# EasyEDA Pro project RP-LoRA_Mini_v2-1.eprj

# Schematic Schematic
Board Name: Board1; Create Date: 2025-02-13; Page Name: P1; Project Name: RP-LoRA_Mini_v2; Schematic Name: LoRa_Mini_v2.1; Update Date: 2025-08-31; Company: Wizado F4ISE; Drawn: F4ISE; Page Size: A4; Reviewed: F4HVV; Version: V2.1
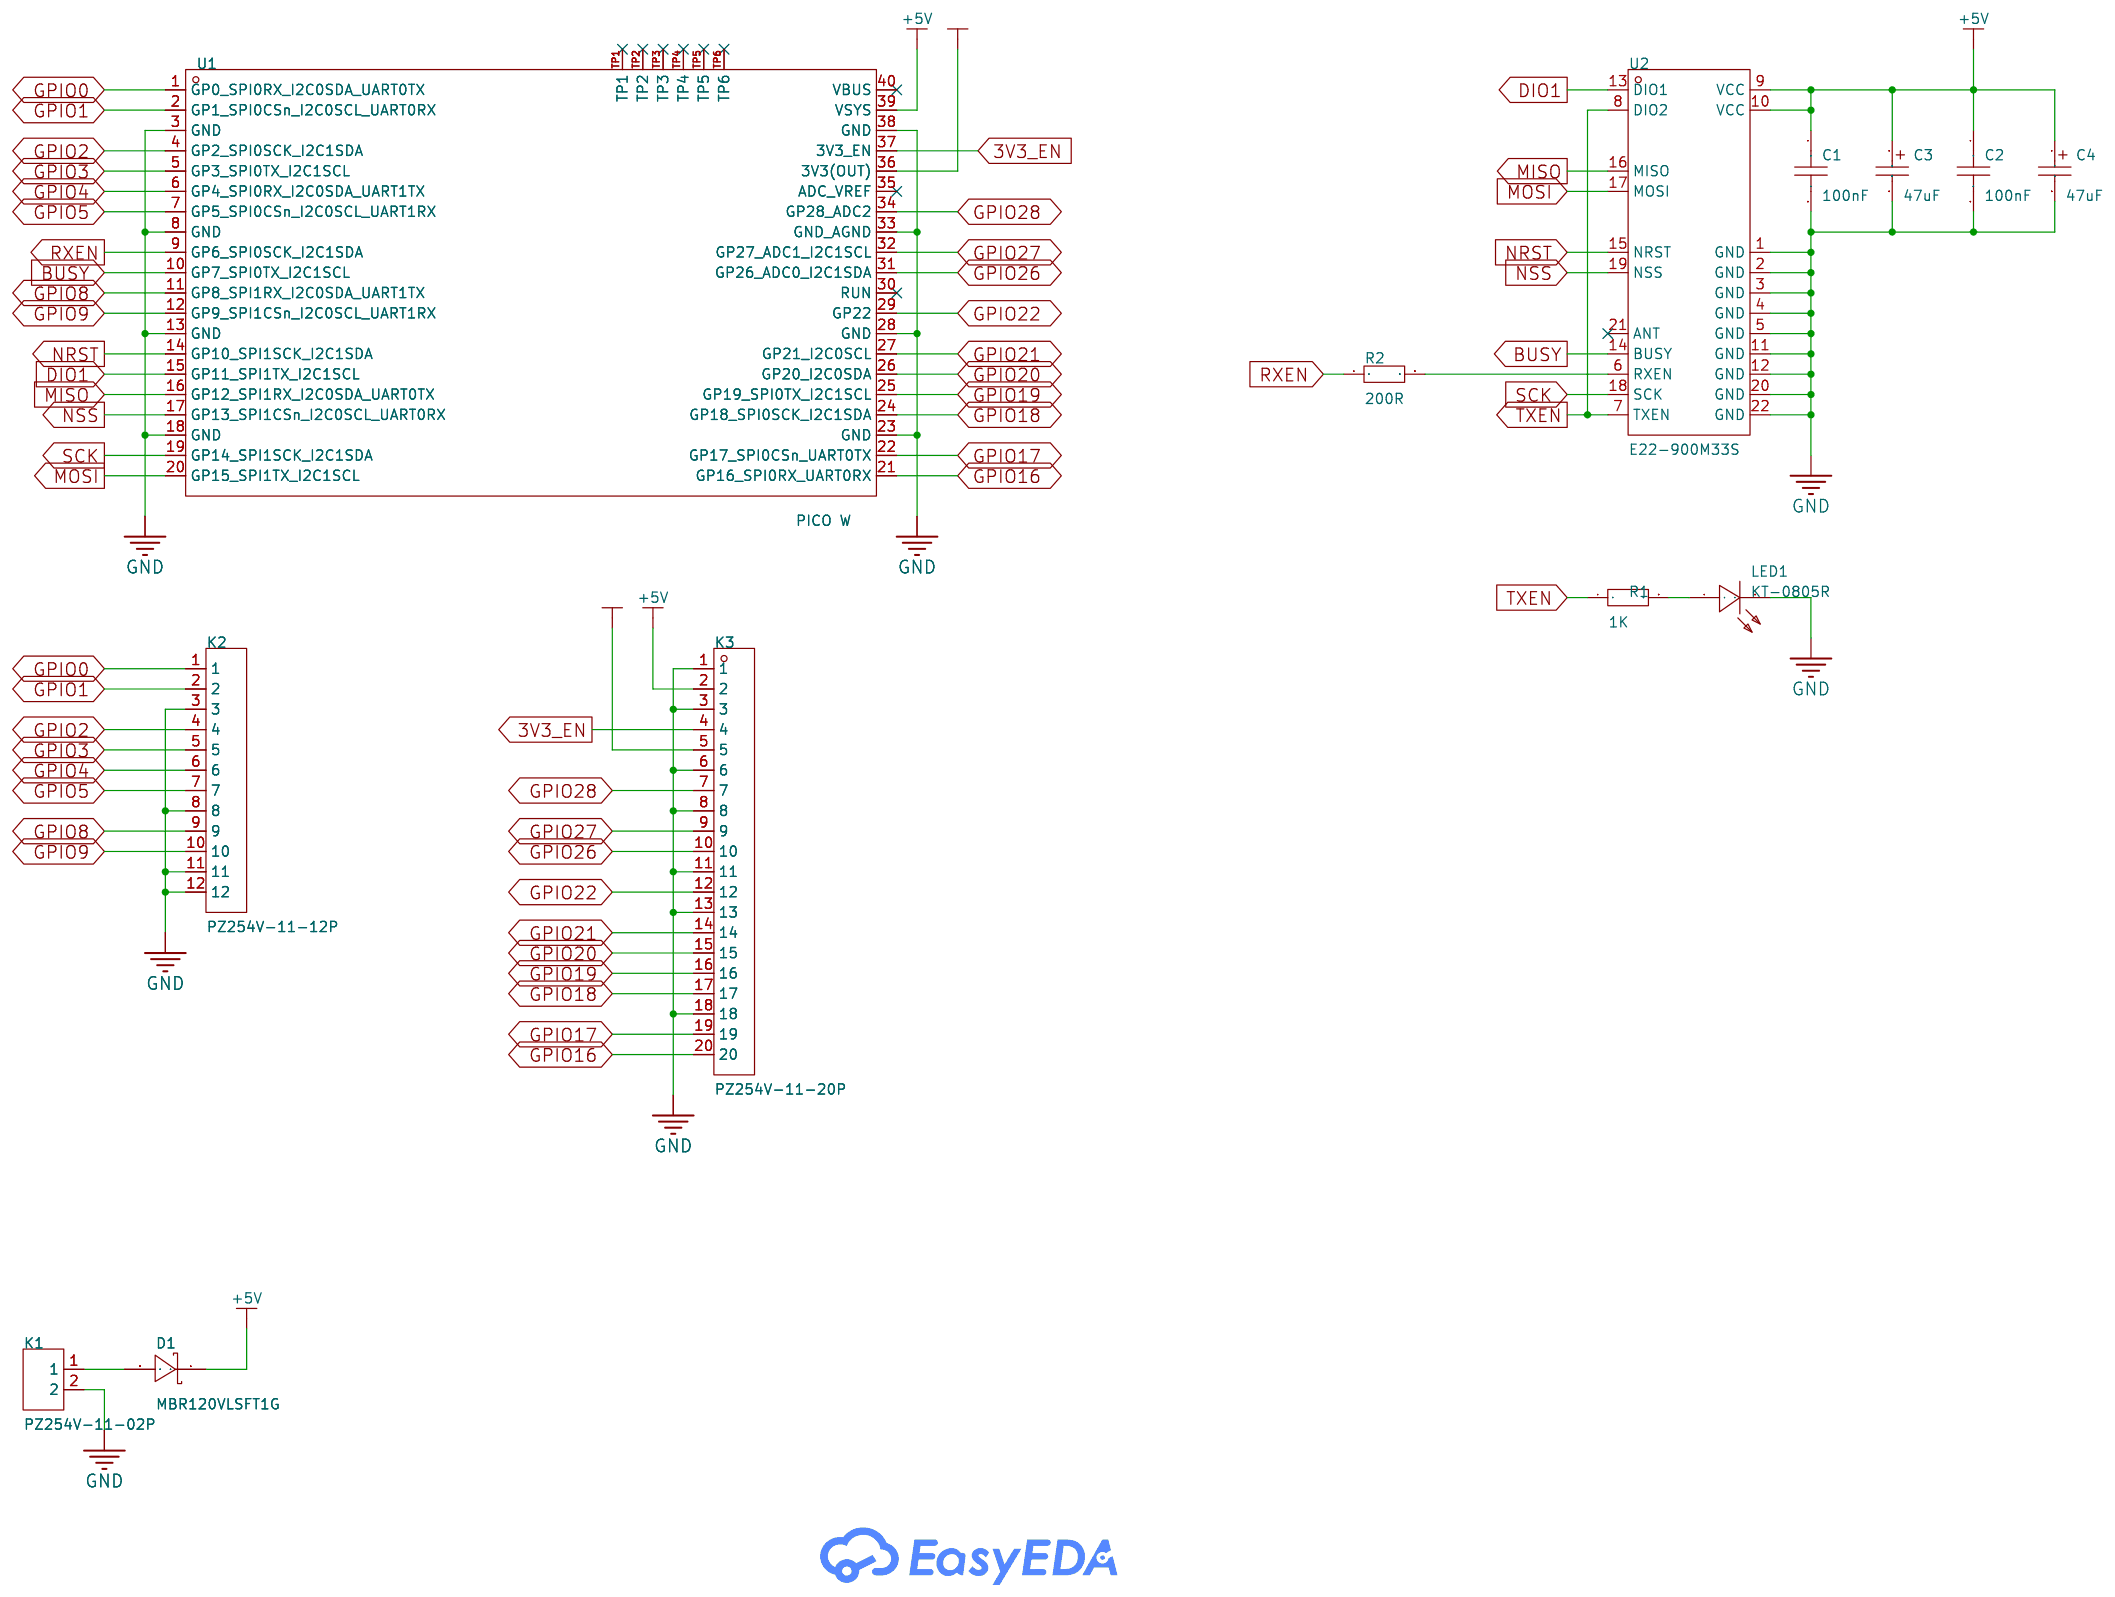
[diagram p0: schematic sheet]

## Parts
C1  100nF  [C0603]
C2  100nF  [C0603]
C3  47uF  [CASE-B_3528]
C4  47uF  [CASE-B_3528]
D1  MBR120VLSFT1G  [SOD-123F_L2.8-W1.8-LS3.7-RD]
K1  PZ254V-11-02P  [HDR-TH_2P-P2.54-V-M]
K2  PZ254V-11-12P  [HDR-TH_12P-P2.54-V-M]
K3  PZ254V-11-20P  [HDR-TH_20P-P2.54-V-M-4]
LED1  KT-0805R  [LED0805-R-RD]
R1  1K  [R0603]
R2  200R  [R0603]
U1  PICO W  [COMM-SMD_L51.0-W21.0-P2.54_PICOW]
U2  E22-900M33S  [COMM-SMD_22P-P2.54-L38.5-W24.0_E22-400M33S]

## Library data of the parts
C1 C2 = CAP_0603: Supplier Footprint: 0603
C3 C4 = CA45-B-10V-47uF-K: LCSC Part Name: 47uF ±10% 10V; Supplier Part: C136658; Manufacturer: CEC(振华新云); Supplier Footprint: CASE-B-3528-19(mm); JLCPCB Part Class: Extended Part; Datasheet: https://item.szlcsc.com/datasheet/CA45-B-10V-47uF-K/147974.html; Supplier: LCSC; Tolerance: ±10%; Voltage Rating: 10V; Equivalent Series Resistance(ESR): 2.4Ω@100kHz; Operating Temperature: -55℃~+125℃
D1 = MBR120VLSFT1G: LCSC Part Name: 电压:20V 电流:1A; Supplier Part: C223608; Manufacturer: onsemi(安森美); Supplier Footprint: SOD-123FL; JLCPCB Part Class: Extended Part; Datasheet: https://atta.szlcsc.com/upload/public/pdf/source/20221020/29D26ECD33A75D76A8E47ED9553F3BCF.pdf; Supplier: LCSC; Forward Voltage (Vf@If): 300mV@1A; Reverse Voltage (Vr): 20V; Average Rectified Current (Io): 1A; Reverse Leakage Current (Ir): 600uA@20V
K1 = PZ254V-11-02P: LCSC Part Name: 1x2P 间距:2.54mm 方针 直插; Supplier Part: C492401; Manufacturer: XFCN(兴飞); Supplier Footprint: 插件,P=2.54mm; JLCPCB Part Class: Extended Part; Datasheet: https://atta.szlcsc.com/upload/public/pdf/source/20200309/C492401_A812433581A9B211A7FFA413ADDFF0E5.pdf; Supplier: LCSC; Pin Structure: 1x2P; Pitch: 2.54mm; Circluar Pins/Square Pins: Policy; Mounting Type: Straight; Number of Rows: Single Row; Number of Pins: 2P; Length of Mating Pin: 6mm; Insulation Height: 2.5mm; Length of End Connection Pin: 3mm; Contact Material: Brass; Operating Temperature: -40℃~+105℃; Color: Black
K2 = PZ254V-11-12P: LCSC Part Name: 1x12P 间距:2.54mm 方针 直插; Supplier Part: C2840012; Manufacturer: XFCN(兴飞); Supplier Footprint: 插件,P=2.54mm; JLCPCB Part Class: Extended Part; Datasheet: https://atta.szlcsc.com/upload/public/pdf/source/20200309/C492403_F9F19131791D08044AD4F84F8E751A34.pdf; Supplier: LCSC; Pin Structure: 1x12P; Pitch: 2.54mm; Circluar Pins/Square Pins: Policy; Mounting Type: Straight; Number of Rows: Single Row; Number of Pins: 12P; Current Rating: 3A; Voltage Rating (Max): 250V; Length of Mating Pin: 6mm; Insulation Height: 2.5mm; Length of End Connection Pin: 3mm; Operating Temperature: -40℃~+105℃; Color: Black
K3 = PZ254V-11-20P: LCSC Part Name: 排针2.54mm间距 单排 1x20P 直插 方针; Supplier Part: C22465880; Manufacturer: XFCN(兴飞); Supplier Footprint: 插件,P=2.54mm; JLCPCB Part Class: Extended Part; Datasheet: https://atta.szlcsc.com/upload/public/pdf/source/20240617/C325FF89D0FCE13B2A10BE2D3D7E6B84.pdf; Supplier: LCSC
LED1 = KT-0805R: LCSC Part Name: 0805 红灯 高亮; Supplier Part: C2295; Manufacturer: KENTO; Supplier Footprint: 0805; JLCPCB Part Class: Extended Part; Supplier: LCSC
R1 R2 = Res_0603: Supplier Footprint: 0603
U1 = PICO W: Supplier Part: C7203003; Manufacturer: Raspberry Pi(树莓派); JLCPCB Part Class: Extended Part; Datasheet: https://atta.szlcsc.com/upload/public/pdf/source/20230906/10B4C0665D815973E97A5F4971CA719F.pdf; Supplier: LCSC
U2 = E22-900M33S: LCSC Part Name: LoRa扩频无线模块2W大功率升级SX1268/1262芯片SPI 915M; Supplier Part: C22399506; Manufacturer: EBYTE(亿佰特); Supplier Footprint: SMD,38.5x24mm; JLCPCB Part Class: Extended Part; Datasheet: https://atta.szlcsc.com/upload/public/pdf/source/20240515/3933576661C2C75726A6AADE06C4B1B1.pdf; Supplier: LCSC; Output Power: 33.5dBm; Support Interface: SPI; Modulation System: LoRa；GFSK; Operating Voltage: 3.3V~5.5V; Antenna Type: Stamp hole antenna；IPEX Interface; Receive  Current: 15mA; Send  Current: 1200mA; Sensitivity: -136dBm; Communication Distance: 16km

## Nets
3V3_EN: K3.4 U1.37(3V3_EN)
+3V3: K3.5 U1.36(3V3(OUT))
+5V: C1.1 C2.1 C3.1 C4.1 D1.1(K) K3.2 U1.39(VSYS) U2.9(VCC) U2.10(VCC)
GND: C1.2 C2.2 C3.2 C4.2 K1.2 K2.3 K2.8 K2.11 K2.12 K3.1 K3.3 K3.6 K3.8 K3.11 K3.13 K3.18 LED1.2(K) U1.3(GND) U1.8(GND) U1.13(GND) U1.18(GND) U1.23(GND) U1.28(GND) U1.33(GND_AGND) U1.38(GND) U2.1(GND) U2.2(GND) U2.3(GND) U2.4(GND) U2.5(GND) U2.11(GND) U2.12(GND) U2.20(GND) U2.22(GND)
BUSY: U1.10(GP7_SPI0TX_I2C1SCL) U2.14(BUSY)
DIO1: U1.15(GP11_SPI1TX_I2C1SCL) U2.13(DIO1)
GPIO0: K2.1 U1.1(GP0_SPI0RX_I2C0SDA_UART0TX)
GPIO1: K2.2 U1.2(GP1_SPI0CSn_I2C0SCL_UART0RX)
GPIO2: K2.4 U1.4(GP2_SPI0SCK_I2C1SDA)
GPIO3: K2.5 U1.5(GP3_SPI0TX_I2C1SCL)
GPIO4: K2.6 U1.6(GP4_SPI0RX_I2C0SDA_UART1TX)
GPIO5: K2.7 U1.7(GP5_SPI0CSn_I2C0SCL_UART1RX)
GPIO8: K2.9 U1.11(GP8_SPI1RX_I2C0SDA_UART1TX)
GPIO9: K2.10 U1.12(GP9_SPI1CSn_I2C0SCL_UART1RX)
GPIO16: K3.20 U1.21(GP16_SPI0RX_UART0RX)
GPIO17: K3.19 U1.22(GP17_SPI0CSn_UART0TX)
GPIO18: K3.17 U1.24(GP18_SPI0SCK_I2C1SDA)
GPIO19: K3.16 U1.25(GP19_SPI0TX_I2C1SCL)
GPIO20: K3.15 U1.26(GP20_I2C0SDA)
GPIO21: K3.14 U1.27(GP21_I2C0SCL)
GPIO22: K3.12 U1.29(GP22)
GPIO26: K3.10 U1.31(GP26_ADC0_I2C1SDA)
GPIO27: K3.9 U1.32(GP27_ADC1_I2C1SCL)
GPIO28: K3.7 U1.34(GP28_ADC2)
MISO: U1.16(GP12_SPI1RX_I2C0SDA_UART0TX) U2.16(MISO)
MOSI: U1.20(GP15_SPI1TX_I2C1SCL) U2.17(MOSI)
NRST: U1.14(GP10_SPI1SCK_I2C1SDA) U2.15(NRST)
NSS: U1.17(GP13_SPI1CSn_I2C0SCL_UART0RX) U2.19(NSS)
RXEN: R2.1 U1.9(GP6_SPI0SCK_I2C1SDA)
SCK: U1.19(GP14_SPI1SCK_I2C1SDA) U2.18(SCK)
TXEN: R1.1 U2.7(TXEN) U2.8(DIO2)
$1N3995: LED1.1(A) R1.2
$1N5348: D1.2(A) K1.1
$1N14481: R2.2 U2.6(RXEN)

Not connected (* = marked no-connect by the designer): U1 30(RUN)* 35(ADC_VREF)* 40(VBUS)* TP1* TP2* TP3* TP4* TP5* TP6*; U2 21(ANT)*

# Board PCB
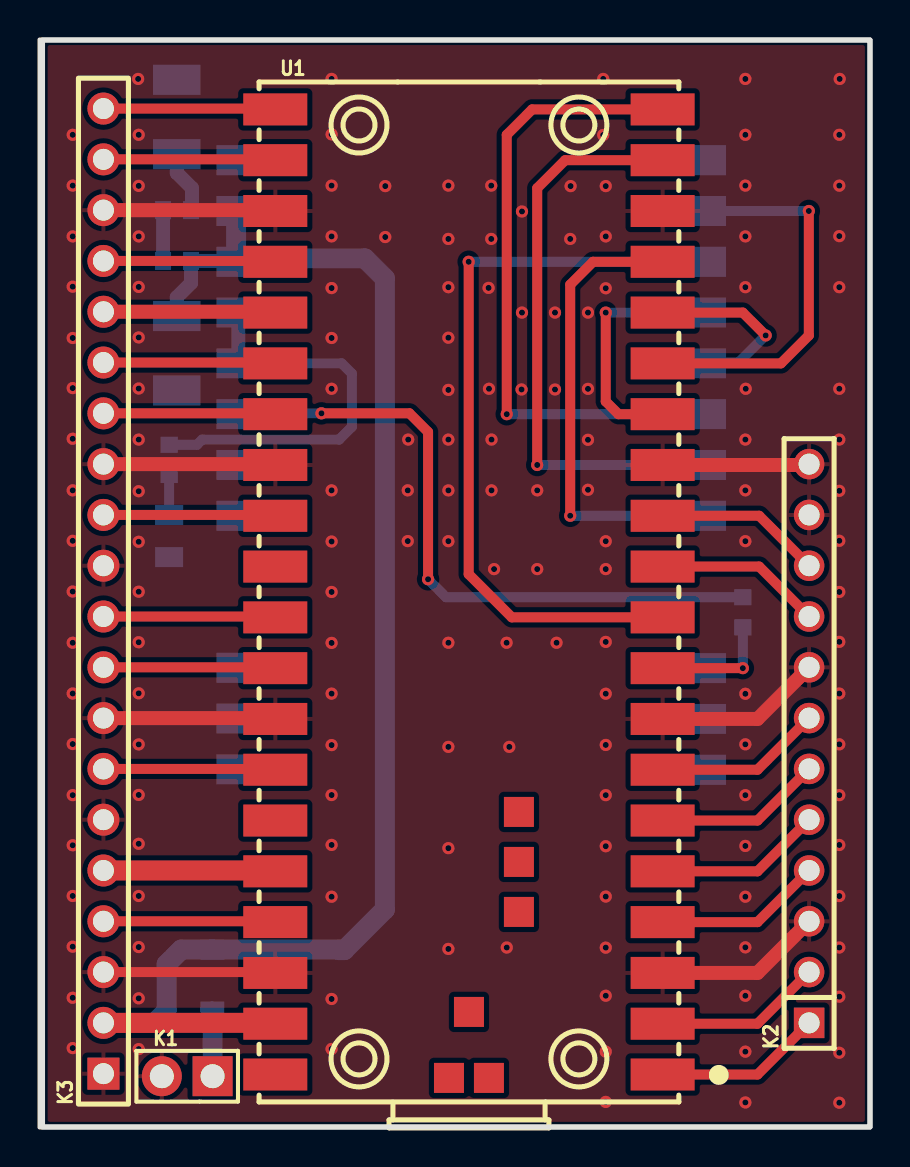
[diagram p1: board, top side]
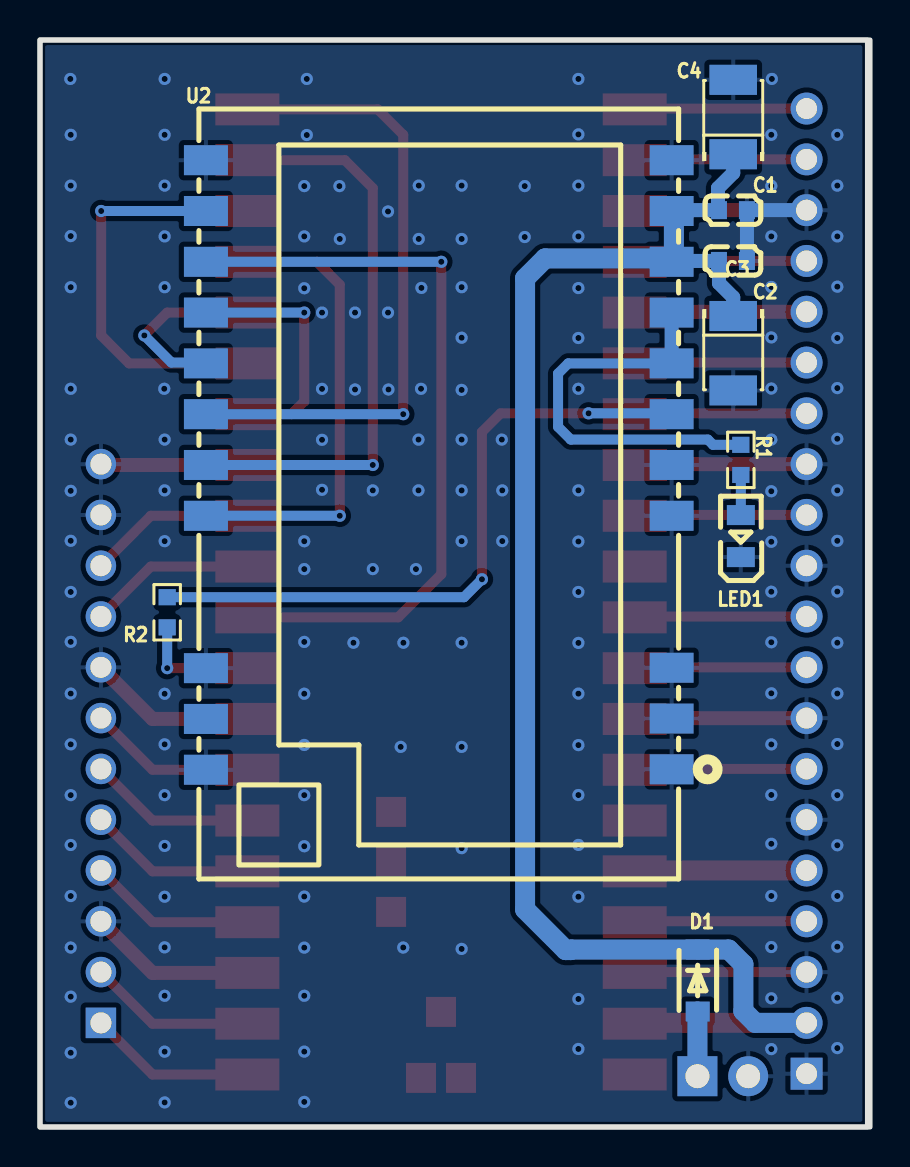
[diagram p2: board, bottom side, seen from below]

Outline 41.53 x 54.36 mm; copper layers: Top Layer, Inner1, Inner2, Bottom Layer. Coordinates in mm from the lower left corner of the outline.
Outline path: rectangle 0,54.36 41.53,0 ; rectangle 0.13,54.36 41.53,0
Stack: Top Layer 0.035mm Outer layer thickness 1oz / Dielectric1 0.2104mm 7628 RC49% 8.6mil / Inner1 0.0152mm Inner layer thickness / Dielectric2 1.065mm 1.1mm H/HOZ Copper / Inner2 0.0152mm Inner layer thickness / Dielectric3 0.2104mm 7628 RC49% 8.6mil / Bottom Layer 0.035mm Outer layer thickness 1oz

## Design rules (mm)
template: JLCPCB Capability(Two Layers Board)
spacing copperThickness1oz (default): track to track 0.102, other pairs 0.152 to 0.3
spacing copperThickness2oz: track to track 0.203, other pairs 0.152 to 0.3
track width copperThickness1oz (default): min 0.127, default 0.254, max 2.54
track width copperThickness2oz: min 0.203, default 0.254, max 2.54
differential pair differentialPair (default): width min 0.127, default 0.254, max 2.54; gap min 0.152, default 0.152
via viaSize (default): diameter min 0.5, default 0.61, max 10; hole min 0.3, default 0.305, max 6.3

## Placement (name value [footprint] x y rotation side)
C1  100nF  [C0603]  6.86 45.85 180 bottom
C2  100nF  [C0603]  6.86 43.31 180 bottom
C3  47uF  [CASE-B_3528]  6.84 38.69 270 bottom
C4  47uF  [CASE-B_3528]  6.84 50.5 90 bottom
D1  MBR120VLSFT1G  [SOD-123F_L2.8-W1.8-LS3.7-RD]  8.62 7.32 270 bottom
K1  PZ254V-11-02P  [HDR-TH_2P-P2.54-V-M]  7.37 2.54 180 top
K2  PZ254V-11-12P  [HDR-TH_12P-P2.54-V-M]  38.48 19.18 90 top
K3  PZ254V-11-20P  [HDR-TH_20P-P2.54-V-M-4]  3.18 26.8 90 top
LED1  KT-0805R  [LED0805-R-RD]  6.46 29.55 90 bottom
R1  1K  [R0603]  6.46 33.36 270 bottom
R2  200R  [R0603]  35.17 25.74 90 bottom
U1  PICO W  [COMM-SMD_L51.0-W21.0-P2.54_PICOW]  21.46 26.67 90 top
U2  E22-900M33S  [COMM-SMD_22P-P2.54-L38.5-W24.0_E22-400M33S]  21.58 33.11 180 bottom

## Footprints (pads in the part's own frame, mm; a bottom-side part is the same pattern mirrored in y, then rotated)
C0603
  rect 0.8x0.9 smd: 1(-0.7,0) 2(0.7,0)
CASE-B_3528
  rect 1.506x2.376 smd: 1(-1.861,0) 2(1.861,0)
COMM-SMD_22P-P2.54-L38.5-W24.0_E22-400M33S
  rect 2.2x1.5 smd: 1(11.65,-15.22) 2(11.65,-12.68) 3(11.65,-10.14) 4(11.65,-2.54) 5(11.65,0) 6(11.65,2.54) 7(11.65,5.08) 8(11.65,7.62) 9(11.65,10.16) 10(11.65,12.7) 11(11.65,15.24) 12(-11.65,15.24) 13(-11.65,12.7) 14(-11.65,10.16) 15(-11.65,7.62) 16(-11.65,5.08) 17(-11.65,2.54) 18(-11.65,0) 19(-11.65,-2.54) 20(-11.65,-10.16) 21(-11.65,-12.7) 22(-11.65,-15.24)
COMM-SMD_L51.0-W21.0-P2.54_PICOW
  rect 1.6x3.2 smd: 1(-24.045,-9.69) 2(-21.505,-9.69) 3(-18.965,-9.69) 4(-16.425,-9.69) 5(-13.885,-9.69) 6(-11.345,-9.69) 7(-8.805,-9.69) 8(-6.265,-9.69) 9(-3.725,-9.69) 10(-1.185,-9.69) 11(1.355,-9.69) 12(3.895,-9.69) 13(6.435,-9.69) 14(8.975,-9.69) 15(11.515,-9.69) 16(14.055,-9.69) 17(16.595,-9.69) 18(19.135,-9.69) 19(21.675,-9.69) 20(24.215,-9.69) 21(24.215,9.69) 22(21.675,9.69) 23(19.135,9.69) 24(16.595,9.69) 25(14.055,9.69) 26(11.515,9.69) 27(8.975,9.69) 28(6.435,9.69) 29(3.895,9.69) 30(1.355,9.69) 31(-1.185,9.69) 32(-3.725,9.69) 33(-6.265,9.69) 34(-8.805,9.69) 35(-11.345,9.69) 36(-13.885,9.69) 37(-16.425,9.69) 38(-18.965,9.69) 39(-21.505,9.69) 40(-24.045,9.69)
  rect 1.5x1.5 smd: TP1(-20.915,0) TP2(-24.215,1) TP3(-24.215,-1) TP4(-15.915,-2.499) TP5(-13.415,-2.499) TP6(-10.915,-2.499)
HDR-TH_2P-P2.54-V-M
  rect 2x2 hole 1.2: 1(-1.27,0)
  round 2 hole 1.2: 2(1.27,0)
HDR-TH_12P-P2.54-V-M
  rect 1.524x1.524 hole 1.05: 1(-13.97,0)
  round 1.524 hole 1.05: 2(-11.43,0) 3(-8.89,0) 4(-6.35,0) 5(-3.81,0) 6(-1.27,0) 7(1.27,0) 8(3.81,0) 9(6.35,0) 10(8.89,0) 11(11.43,0) 12(13.97,0)
HDR-TH_20P-P2.54-V-M-4
  rect 1.6x1.6 hole 1.05: 1(-24.13,0)
  round 1.6 hole 1.05: 2(-21.59,0) 3(-19.05,0) 4(-16.51,0) 5(-13.97,0) 6(-11.43,0) 7(-8.89,0) 8(-6.35,0) 9(-3.81,0) 10(-1.27,0) 11(1.27,0) 12(3.81,0) 13(6.35,0) 14(8.89,0) 15(11.43,0) 16(13.97,0) 17(16.51,0) 18(19.05,0) 19(21.59,0) 20(24.13,0)
LED0805-R-RD
  rect 1x1.399 smd: 1(1.05,0) 2(-1.05,0)
R0603
  rect 0.806x0.864 smd: 1(-0.753,0) 2(0.753,0)
SOD-123F_L2.8-W1.8-LS3.7-RD
  rect 1x1.2 smd: 1(-1.55,0) 2(1.55,0)

## Nets
As in the schematic.

Pads without a net: U1 30 35 40 TP1 TP2 TP3 TP4 TP5 TP6; U2 21

## Via types
v1: diameter 0.61, hole 0.305, Top Layer to Bottom Layer, 163 vias

## Routing (per net, layer and track width the routed paths; a pad name or vN(x,y) marks a point on that pad's centre or on a via; arc(x,y) is an arc through that point)
3V3_EN: length 8.6
  Top Layer w0.5: K3.4 11.73,10.29 U1.37
+3V3: length 8.6
  Top Layer w1: K3.5 11.73,12.83 U1.36
+5V: length 79.1
  Top Layer w1: K3.2 11.73,5.21 U1.39
  Bottom Layer w0.7: C4.1 6.84,47.71 7.61,46.95 7.61,45.89 C1.1 9.81,45.85 ; 9.81,43.31 C2.1 7.56,42.2 6.84,41.49 C3.1
  Bottom Layer w1: 9.81,45.85 9.81,43.31 10.19,43.31 10.32,43.43 16.26,43.43 17.26,42.43 17.26,10.88 15.23,8.85 14.97,8.85 14.95,8.87 D1.1 7.07,8.87 6.34,8.14 6.34,5.8 5.74,5.21 K3.2
GND: length 63.4
  Top Layer w0.5: U1.38 11.73,7.75 K3.3
  Top Layer w0.7: K3.13 11.73,33.15 U1.28 ; U1.8 35.9,20.41 K2.8 ; U1.3 35.9,7.7 K2.3 ; K3.8 11.73,20.45 U1.33 ; U1.13 38.44,33.11 K2.12 ; U1.23 11.73,45.85 3.94,45.85
  Bottom Layer w0.7: C2.2 C1.2 K3.18
  vias: v1(1.64,49.61) v1(1.64,47.08) v1(1.64,44.53) v1(1.64,42.02) v1(1.64,39.45) v1(1.64,36.95) v1(1.64,34.42) v1(1.64,31.83) v1(1.64,29.31) v1(1.64,26.78) v1(1.64,24.22) v1(1.64,21.68) v1(1.64,19.15) v1(1.64,16.59) v1(1.64,14.09) v1(1.64,11.55) v1(1.64,9.02) v1(1.64,6.46) v1(1.64,3.95) v1(4.91,52.41) v1(4.94,49.61) v1(4.94,47.06) v1(4.94,44.53) v1(4.94,42.01) v1(4.94,39.48) v1(4.94,36.93) v1(4.94,34.38) v1(4.94,31.79) v1(4.94,29.27) v1(4.94,26.77) v1(4.94,24.24) v1(4.94,21.69) v1(4.94,19.13) v1(4.94,16.61) v1(4.94,14.16) v1(4.94,11.55) v1(4.94,9) v1(4.94,6.44) v1(4.94,3.89) v1(14.59,52.41) v1(14.59,49.63) v1(14.59,47.08) v1(14.59,44.53) v1(14.59,41.95) v1(14.59,39.45) v1(14.59,36.91) v1(14.59,31.83) v1(14.59,29.28) v1(14.59,26.75) v1(14.59,24.21) v1(14.59,21.67) v1(14.59,19.1) v1(14.59,16.6) v1(14.59,14.11) v1(14.59,11.52) v1(14.59,6.4) v1(14.59,3.9) v1(17.28,47.05) v1(17.28,44.5) v1(18.42,34.38) v1(18.4,31.83) v1(18.4,29.3) v1(20.43,47.08) v1(20.43,44.41) v1(20.43,42) v1(20.43,39.47) v1(20.43,36.86) v1(20.43,34.38) v1(20.43,31.83) v1(20.43,29.3) v1(20.43,24.22) v1(20.43,19.01) v1(20.43,13.94) v1(20.43,8.91) v1(22.45,41.96) v1(22.47,36.91) v1(22.58,47.08) v1(22.58,44.41) v1(22.59,34.38) v1(22.59,31.83) v1(22.72,27.9) v1(23.35,24.22) v1(23.35,8.97) v1(23.48,19.01) v1(24.12,45.78) v1(24.12,40.72) v1(24.09,36.88) v1(24.88,31.83) v1(24.88,27.9) v1(25.77,40.72) v1(25.77,36.88) v1(25.84,24.22) v1(26.55,47.05) v1(26.53,44.41) v1(27.42,40.72) v1(27.42,36.91) v1(27.42,34.36) v1(27.42,31.86) v1(28.18,52.41) v1(28.18,49.6) v1(28.31,47.05) v1(28.31,44.53) v1(28.31,41.94) v1(28.31,29.29) v1(28.31,27.9) v1(28.31,24.26) v1(28.31,21.67) v1(28.31,19.11) v1(28.31,16.59) v1(28.31,14.04) v1(28.31,11.52) v1(28.31,8.97) v1(28.31,6.56) v1(28.31,3.77) v1(28.31,1.25) v1(35.29,52.41) v1(35.29,49.61) v1(35.29,47.08) v1(35.29,44.53) v1(35.29,42) v1(35.31,36.91) v1(35.29,34.38) v1(35.29,31.83) v1(35.29,29.3) v1(35.29,21.66) v1(35.29,19.13) v1(35.29,16.59) v1(35.29,14.05) v1(35.29,11.52) v1(35.29,8.98) v1(35.29,6.56) v1(35.29,3.77) v1(35.29,1.23) v1(40.01,52.41) v1(39.99,49.61) v1(39.99,47.07) v1(39.99,44.55) v1(39.99,42) v1(39.99,36.91) v1(39.99,34.38) v1(39.99,31.81) v1(39.99,29.31) v1(39.99,26.75) v1(39.99,24.26) v1(39.99,21.67) v1(39.99,19.13) v1(39.99,16.59) v1(39.99,14.1) v1(39.99,11.55) v1(39.99,8.97) v1(39.99,6.52) v1(39.99,3.71) v1(39.99,1.22)
BUSY: length 37.9
  Top Layer w0.5: U1.10 23.61,25.48 21.45,27.64 v1(21.45,43.27)
  Bottom Layer w0.5: v1(21.45,43.27) 33.07,43.27 33.11,43.31
DIO1: length 19.5
  Top Layer w0.5: v1(38.47,45.8) 38.47,39.58 37.07,38.19 U1.15
  Bottom Layer w0.5: 33.11,45.85 33.16,45.8 v1(38.47,45.8)
GPIO0: length 8.4
  Top Layer w0.5: K2.1 35.9,2.62 U1.1
GPIO1: length 8.4
  Top Layer w0.5: U1.2 35.9,5.16 K2.2
GPIO2: length 8.4
  Top Layer w0.5: K2.4 35.9,10.25 U1.4
GPIO3: length 8.4
  Top Layer w0.5: K2.5 35.9,12.78 U1.5
GPIO4: length 8.4
  Top Layer w0.5: U1.6 35.9,15.33 K2.6
GPIO5: length 8.4
  Top Layer w0.5: K2.7 35.9,17.86 U1.7
GPIO8: length 8.4
  Top Layer w0.5: K2.9 35.98,28.02 U1.11
GPIO9: length 8.4
  Top Layer w0.5: U1.12 35.98,30.56 K2.10
GPIO16: length 8.6
  Top Layer w0.5: K3.20 11.73,50.93 U1.21
GPIO17: length 8.6
  Top Layer w0.5: U1.22 11.73,48.39 K3.19
GPIO18: length 8.6
  Top Layer w0.5: U1.24 11.73,43.31 K3.17
GPIO19: length 8.6
  Top Layer w0.7: K3.16 11.73,40.77 U1.25
GPIO20: length 8.6
  Top Layer w0.5: K3.15 11.73,38.23
  Top Layer w0.7: 11.73,38.23 U1.26
GPIO21: length 8.6
  Top Layer w0.5: U1.27 11.73,35.69 K3.14
GPIO22: length 8.6
  Top Layer w0.5: K3.12 11.73,30.61 U1.29
GPIO26: length 8.6
  Top Layer w0.5: U1.31 11.73,25.53 K3.10
GPIO27: length 8.6
  Top Layer w0.5: U1.32 11.73,22.99 K3.9
GPIO28: length 8.6
  Top Layer w0.5: K3.7 11.73,17.91 U1.34
MISO: length 9.4
  Top Layer w0.5: U1.16 35.17,40.72 v1(36.31,39.58)
  Bottom Layer w0.5: 33.11,38.23 34.95,38.23 v1(36.31,39.58)
MOSI: length 32.1
  Top Layer w0.5: v1(23.35,35.64) 23.35,49.61 24.62,50.88 U1.20
  Bottom Layer w0.5: 33.11,35.69 33.07,35.64 v1(23.35,35.64)
NRST: length 12.4
  Top Layer w0.5: U1.14 28.94,35.64 28.31,36.28 v1(28.31,40.72)
  Bottom Layer w0.5: 33.11,40.77 33.07,40.72 v1(28.31,40.72)
NSS: length 23.3
  Top Layer w0.5: v1(26.53,30.56) 26.53,42.12 27.67,43.27 U1.17
  Bottom Layer w0.5: v1(26.53,30.56) 33.07,30.56 33.11,30.61
RXEN: length 6.1
  Top Layer w0.5: U1.9 v1(35.17,22.94)
  Bottom Layer w0.5: v1(35.17,22.94) R2.1
SCK: length 28.9
  Top Layer w0.5: v1(24.88,33.11) 24.88,46.95 26.28,48.34 U1.19
  Bottom Layer w0.5: 33.11,33.15 33.07,33.11 v1(24.88,33.11)
TXEN: length 20.6
  Bottom Layer w0.5: U2.7 15.1,38.19 15.61,37.68 15.61,35.01 14.97,34.38 8.11,34.38 7.85,34.11 R1.1
  Bottom Layer w0.7: U2.8 U2.7
$1N3995: length 2
  Bottom Layer w0.5: R1.2 LED1.1
$1N5348: length 3.2
  Bottom Layer w1: K1.1 8.64,5.76 D1.2
$1N14481: length 33.5
  Top Layer w0.5: v1(19.42,27.39) 19.42,34.76 18.49,35.69 v1(14.08,35.69)
  Bottom Layer w0.5: R2.2 20.31,26.49 v1(19.42,27.39) ; 9.81,35.69 v1(14.08,35.69)

## Copper pours and planes (outline as drawn; the poured copper is in the pictures)
GND on Top Layer: 0,54.36 41.53,54.36 41.53,0 0,0
GND on Bottom Layer: 0.25,54.23 41.66,54.23 41.66,-0.13 0.25,-0.13
GND on Inner1: 0,54.36 41.53,54.36 41.53,0 0,0
GND on Inner2: -0.23,54.36 41.53,54.36 41.53,0 -0.23,0
